# Altium schematic sheet Sheet2.SchDoc
size A4; SheetNumber: 2; SheetTotal: 2
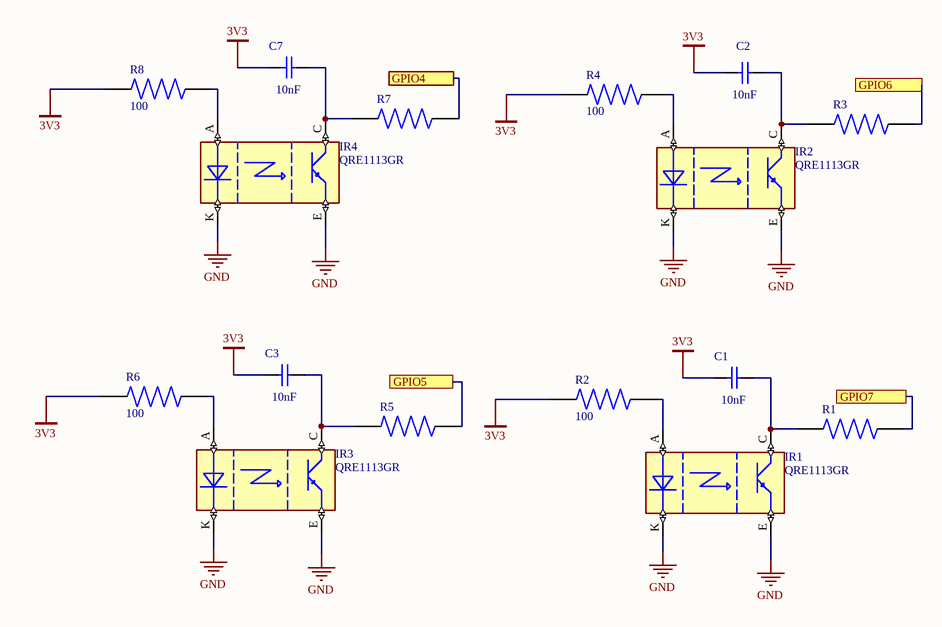
[diagram p0: Sheet2.SchDoc]

## Parts
C1  10nF  [WCAP-CSGP_0805_L2W1.25H1.25]
C2  10nF  [WCAP-CSGP_0805_L2W1.25H1.25]
C3  10nF  [WCAP-CSGP_0805_L2W1.25H1.25]
C7  10nF  [WCAP-CSGP_0805_L2W1.25H1.25]
IR1  QRE1113GR  [4LEADSMD]
IR2  QRE1113GR  [4LEADSMD]
IR3  QRE1113GR  [4LEADSMD]
IR4  QRE1113GR  [4LEADSMD]
R1  220  [RESC1005X35N]  (value not drawn)
R2  100  [RESC6432X75N]
R3  220  [RESC1005X35N]  (value not drawn)
R4  100  [RESC6432X75N]
R5  220  [RESC1005X35N]  (value not drawn)
R6  100  [RESC6432X75N]
R7  220  [RESC1005X35N]  (value not drawn)
R8  100  [RESC6432X75N]

## Ports
GPIO4, GPIO5, GPIO6, GPIO7

## Nets
3V3: C1.1 C2.1 C3.1 C7.1 R2.1 R4.1 R6.1 R8.1
GND: IR1.E IR1.K IR2.E IR2.K IR3.E IR3.K IR4.E IR4.K
GPIO4: R7.2 ; port GPIO4
GPIO5: R5.2 ; port GPIO5
GPIO6: R3.2 ; port GPIO6
GPIO7: R1.2 ; port GPIO7
NetC1_2: C1.2 IR1.C R1.1
NetC2_2: C2.2 IR2.C R3.1
NetC3_2: C3.2 IR3.C R5.1
NetC7_2: C7.2 IR4.C R7.1
NetIR1_A: IR1.A R2.2
NetIR2_A: IR2.A R4.2
NetIR3_A: IR3.A R6.2
NetIR4_A: IR4.A R8.2

## Library data of the parts
C1-C3 C7 = 885012007009: WCAP-CSGP Multilayer Ceramic Chip Capacitor, General Purpose, size 0805, NP0, 10nF, 10V; Manufacturer: Wurth Elektronik; Case/Size Code: 0805; Capacitance Tolerance: +/-5%; Insulation Resistance: 10GΩ; Q Factor: 1000; Technical Reference: NP00805103J010DFCT10000; Manufacturer Part Number: 885012007009; Category: Multilayer Ceramic Chip Capacitors; Match Code: WCAP-CSGP; ComponentLink1Description: Website Link; ComponentLink1URL: https://www.we-online.com/redexpert/article/885012007009?ad; ComponentLink2Description: Datasheet Link; ComponentLink2URL: https://www.we-online.com/redexpert/spec/885012007009?ad; Mount: Surface Mount; Min Operating Temperature: -55°C; Max Operating Temperature: 125°C; Packaging: Tape and Reel; Length: 2mm; Width: 1.25mm; Height: 1.25mm; Capacitance: 10nF; Ceramic Type: NP0; Rated Voltage (DC): 10V
IR1-IR4 = QRE1113GR: Optical Switches, Reflective, Phototransistor Output Reflective Sensor; MF: SparkFun; SnapEDA_Link: https://www.snapeda.com/parts/QRE1113/SparkFun/view-part/?ref=snap; Package: None; Value: *; MP: QRE1113; Check_prices: https://www.snapeda.com/parts/QRE1113/SparkFun/view-part/?ref=eda
R1 R3 R5 R7 = CPF0402B220RE1: Resistencia de pelÃ­cula delgada de precisiÃ³n SMD, carcasa 0402, 220 ohmios +/-0,1 %, 063 W +/-25 ppm/C ¦ TE Connectivity CPF0402B220RE1; Power_Rating: .063 W; Voltage_Rating: 25 V; Tolerance: .1%; SnapEDA_Link: https://www.snapeda.com/parts/CPF0402B220RE1/TE+Connectivity/view-part/?ref=snap; Package: 0402; Resistance: 220; Value: *; MF: TE Connectivity; MP: CPF0402B220RE1; EU_RoHS_Compliance: Compliant; Check_prices: https://www.snapeda.com/parts/CPF0402B220RE1/TE+Connectivity/view-part/?ref=eda
R2 R4 R6 R8 = CRS2512-FX-1000ELF: CRS Series Anti-surge Resistor 2512 Case 100Ohms 2W +/-100ppm/degC | Bourns CRS2512-FX-1000ELF; SnapEDA_Link: https://www.snapeda.com/parts/CRS2512-FX-1000ELF/Bourns/view-part/?ref=snap; Package: 6432 Bourns; Value: *; MF: Bourns; MP: CRS2512-FX-1000ELF; Check_prices: https://www.snapeda.com/parts/CRS2512-FX-1000ELF/Bourns/view-part/?ref=eda